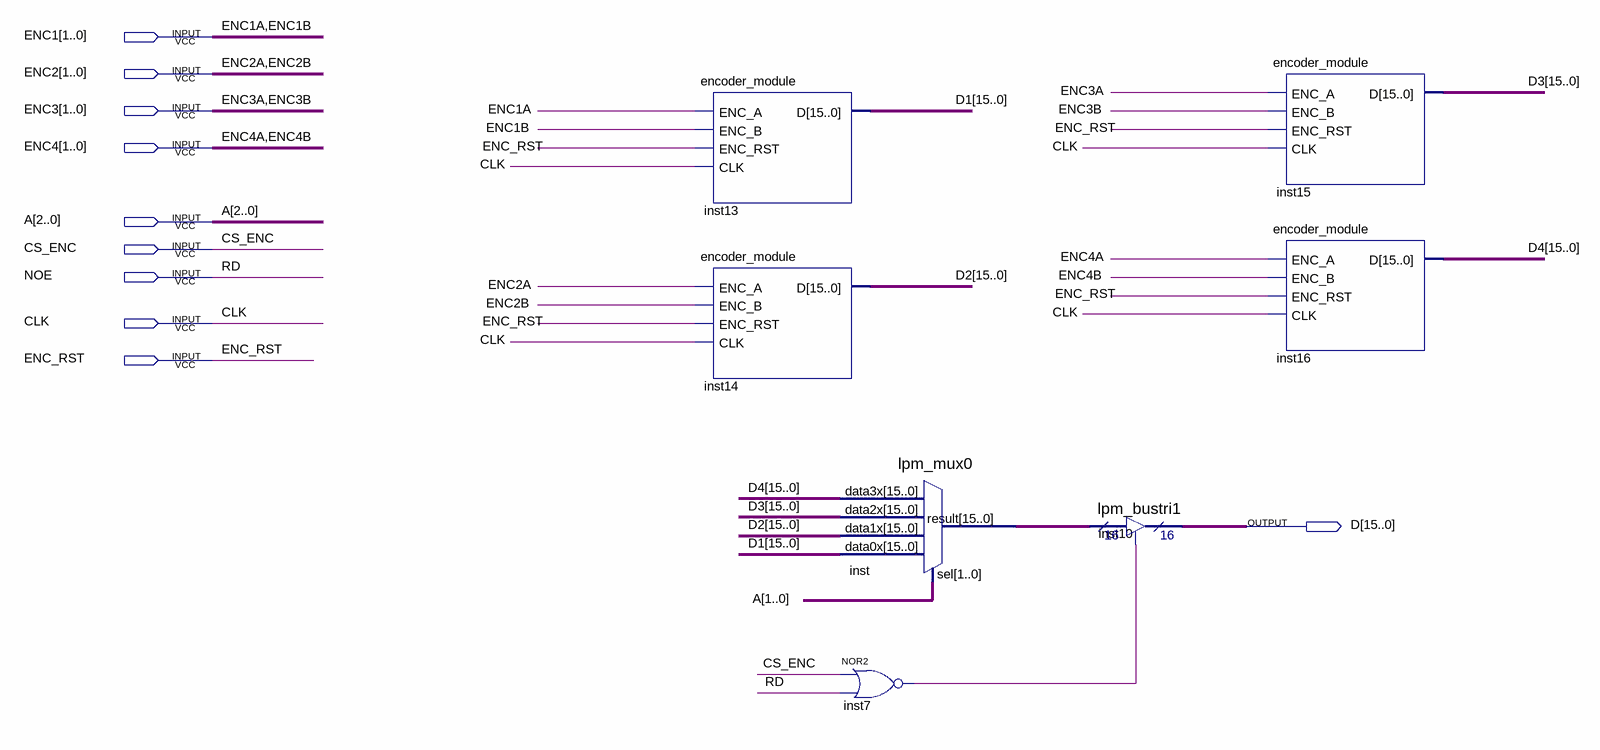
[diagram p0: schematic sheet]
// Quartus schematic encoder_2.bdf as structural Verilog: 7 symbols, 10 pins
module encoder_2 (
  input  [1:0] ENC1,
  input  [1:0] ENC2,
  input  [1:0] ENC3,
  input  [1:0] ENC4,
  input  [2:0] A,
  input  CS_ENC,
  input  NOE,
  input  CLK,
  input  ENC_RST,
  output [15:0] D
);

  wire inst7_out;
  wire [15:0] D1, D2, D3, D4, inst_result;

  encoder_module inst13 (.ENC_A(ENC1[1]), .ENC_B(ENC1[0]), .ENC_RST(ENC_RST), .CLK(CLK), .D(D1));
  encoder_module inst14 (.ENC_A(ENC2[1]), .ENC_B(ENC2[0]), .ENC_RST(ENC_RST), .CLK(CLK), .D(D2));
  lpm_mux0 inst (.data3x(D4), .data2x(D3), .data1x(D2), .data0x(D1), .sel(A[1:0]), .result(inst_result));
  nor inst7 (inst7_out, CS_ENC, NOE);
  lpm_bustri1 inst10 (.enabledt(inst7_out), .data(inst_result), .tridata(D));
  encoder_module inst15 (.ENC_A(ENC3[1]), .ENC_B(ENC3[0]), .ENC_RST(ENC_RST), .CLK(CLK), .D(D3));
  encoder_module inst16 (.ENC_A(ENC4[1]), .ENC_B(ENC4[0]), .ENC_RST(ENC_RST), .CLK(CLK), .D(D4));

  // Other names for the same wires on the sheet: ENC1A = ENC1[1]; ENC1B = ENC1[0]; ENC2A = ENC2[1]; ENC2B = ENC2[0];
  //   ENC3A = ENC3[1]; ENC3B = ENC3[0]; ENC4A = ENC4[1]; ENC4B = ENC4[0]; RD = NOE
endmodule
